# Altium schematic sheet JTAG_STM32.SchDoc
size A4
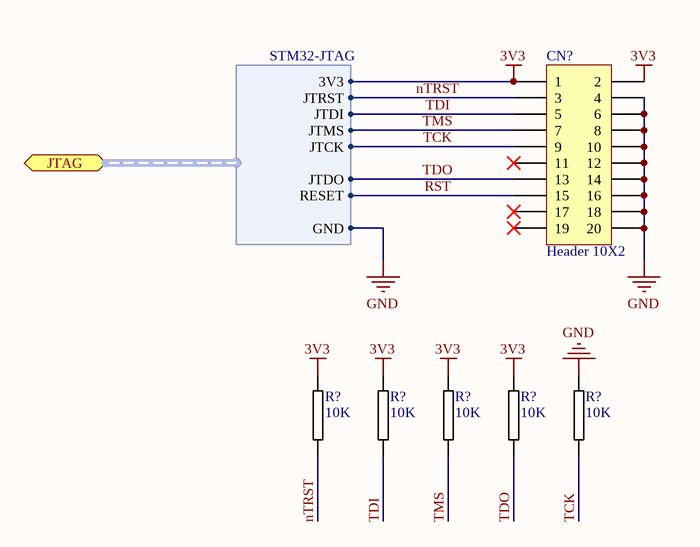
[diagram p0: JTAG_STM32.SchDoc]

## Parts
(Parts that share a designator on the sheet are numbered #1, #2 ... from top to bottom, then left to right.)
CN?  Header 10X2  [HDR2X10]
R?#1  10K  [0603R-10K]
R?#2  10K  [0603R-10K]
R?#3  10K  [0603R-10K]
R?#4  10K  [0603R-10K]
R?#5  10K  [0603R-10K]

## Ports
JTAG (harness STM32-JTAG)

## Harnesses
STM32-JTAG: 3V3, JTRST, JTDI, JTMS, JTCK, JTDO, RESET, GND

## Nets
3V3: CN?.1 CN?.2 R?#1.1 R?#2.1 R?#3.1 R?#5.2 ; port JTAG.3V3
GND: CN?.4 CN?.6 CN?.8 CN?.10 CN?.12 CN?.14 CN?.16 CN?.18 CN?.20 R?#4.1 ; port JTAG.GND
nTRST: CN?.3 ; port JTAG.JTRST
RST: CN?.15 ; port JTAG.RESET
TCK: CN?.9 ; port JTAG.JTCK
TDI: CN?.5 ; port JTAG.JTDI
TDO: CN?.13 ; port JTAG.JTDO
TMS: CN?.7 ; port JTAG.JTMS

Not connected (* = marked no-connect by the designer): CN? 11* 17* 19*; R?#1 2; R?#2 2; R?#3 2; R?#4 2; R?#5 1

## Notes on the sheet
- Labels drawn without touching a wire or pin: nTRST, TCK, TDI, TDO, TMS

## Library data of the parts
CN? = Header 10X2: Header, 10-Pin, Dual row; LatestRevisionDate: 17-Jul-2002; LatestRevisionNote: Re-released for DXP Platform.; Publisher: Altium Limited
R?#1-R?#5 = 0603R-10K: GENERIC RESISTOR 0603; Manufacturer: Stackpole Electronics Inc; Manufacturer Part Number: RMCF 1/16 10K 1% R; Tolerance: ±1%; Power (Watts): 0.1W, 1/10W; Temperature Coefficient: ±100ppm/°C; Resistance In Ohms: 10.0K; Reel: R21; Category: Resistors; Supplier Part Number: RMCF1/1610KFRDKR-ND; Lead Style: Surface Mount (SMD - SMT); RoHS: RoHS Compliant; Packaging: Digi-Reel®; Case: 0603 (1608 metric); Composition: Thick Film; Supplier: Digi-Key; Supplier 1: Digi-Key; Supplier Part Number 1: RMCF0603FT10K0DKR-ND